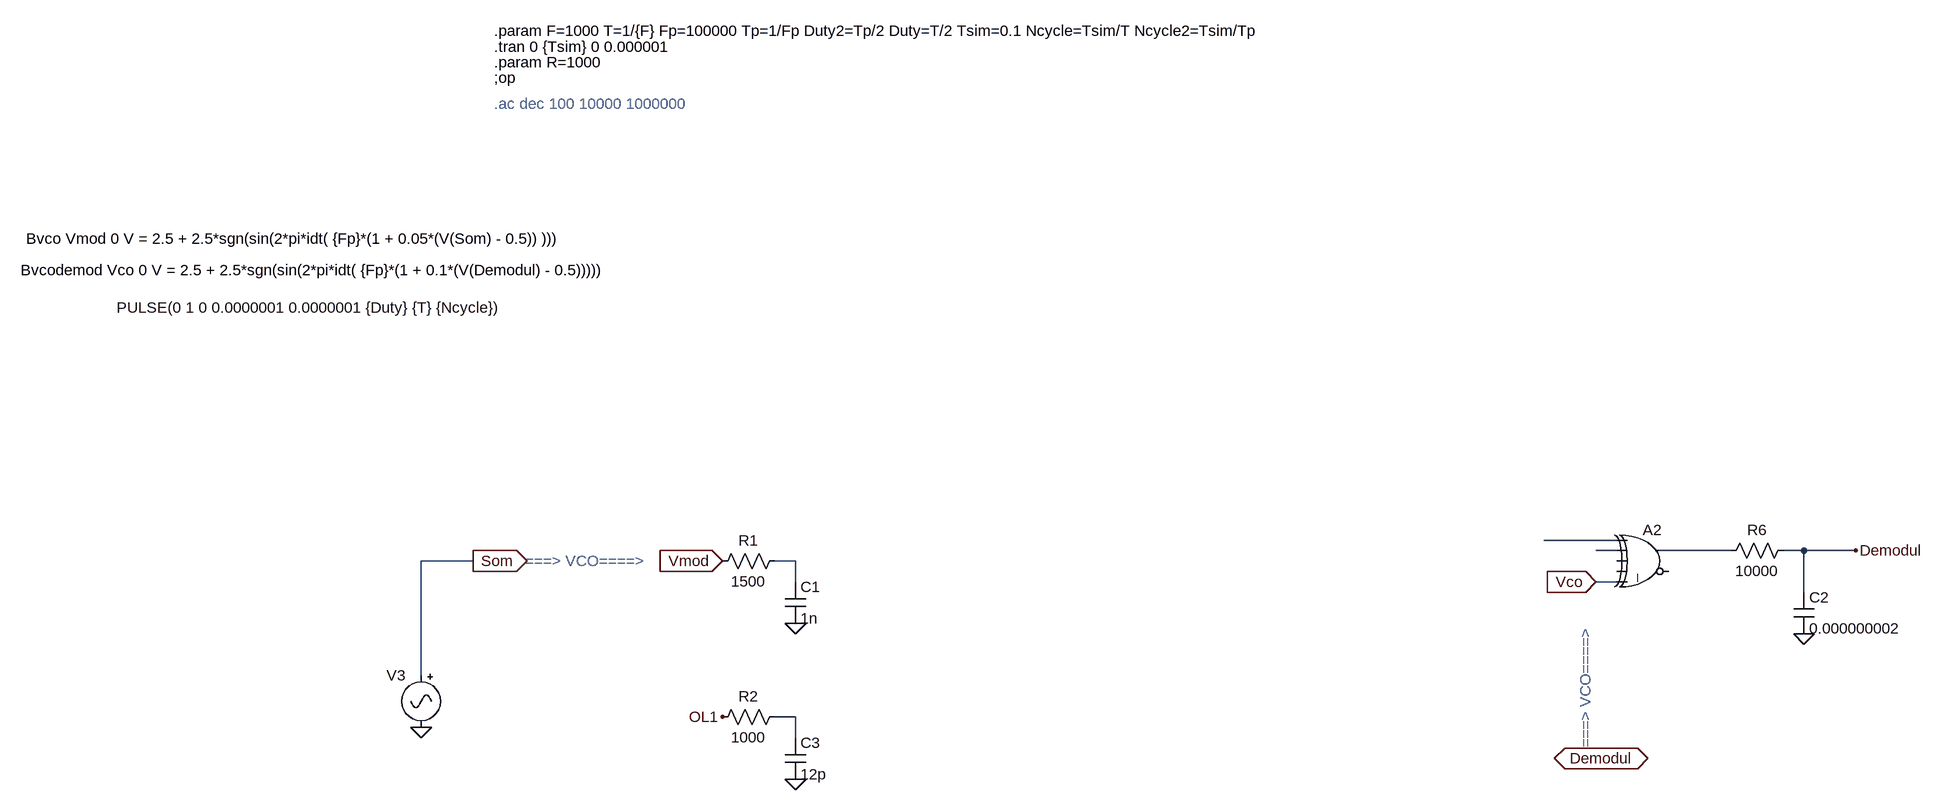
[diagram p0: schematic sommateur.asc]
sommateur.asc, the LTspice schematic file:
Version 4.1
SHEET 1 1820 1652
WIRE 816 160 704 160
WIRE 816 176 784 176
WIRE 992 176 880 176
WIRE 1104 176 1072 176
WIRE 1184 176 1104 176
WIRE -944 192 -1024 192
WIRE -448 192 -480 192
WIRE -448 224 -448 192
WIRE 816 224 784 224
WIRE 1104 240 1104 176
WIRE -1024 368 -1024 192
WIRE -448 432 -480 432
WIRE -448 464 -448 432
FLAG -944 192 Som
IOPIN -944 192 Out
FLAG -1024 448 0
FLAG 1184 176 Demodul
FLAG 784 224 Vco
IOPIN 784 224 In
FLAG 1104 304 0
FLAG 720 496 Demodul
IOPIN 720 496 BiDir
FLAG -560 192 Vmod
IOPIN -560 192 In
FLAG -448 288 0
FLAG -448 528 0
FLAG -560 432 OL1
SYMBOL Misc\\signal -1024 352 M0
WINDOW 123 0 0 Left 0
WINDOW 39 0 0 Left 0
WINDOW 3 -129 -550 Left 2
SYMATTR Value PULSE(0 1 0 0.0000001 0.0000001 {Duty} {T} {Ncycle})
SYMATTR InstName V3
SYMBOL Digital\\xor 864 128 R0
SYMATTR InstName A2
SYMBOL res 1088 160 R90
WINDOW 0 0 56 VBottom 2
WINDOW 3 32 56 VTop 2
SYMATTR InstName R6
SYMATTR Value 10000
SYMBOL cap 1088 240 R0
SYMATTR InstName C2
SYMATTR Value 0.000000002
SYMBOL res -464 176 R90
WINDOW 0 0 56 VBottom 2
WINDOW 3 32 56 VTop 2
SYMATTR InstName R1
SYMATTR Value 1500
SYMBOL cap -464 224 R0
SYMATTR InstName C1
SYMATTR Value 1n
SYMBOL res -464 416 R90
WINDOW 0 0 56 VBottom 2
WINDOW 3 32 56 VTop 2
SYMATTR InstName R2
SYMATTR Value 1000
SYMBOL cap -464 464 R0
SYMATTR InstName C3
SYMATTR Value 12p
TEXT -912 -576 Left 2 !.param R=1000
TEXT -912 -552 Left 2 !;op
TEXT -912 -600 Left 2 !.tran 0 {Tsim} 0 0.000001
TEXT -912 -624 Left 2 !.param F=1000 T=1/{F} Fp=100000 Tp=1/Fp Duty2=Tp/2 Duty=T/2 Tsim=0.1 Ncycle=Tsim/T Ncycle2=Tsim/Tp
TEXT 768 480 VLeft 2 ;===> VCO====>
TEXT -1640 -256 Left 2 !Bvcodemod Vco 0 V = 2.5 + 2.5*sgn(sin(2*pi*idt( {Fp}*(1 + 0.1*(V(Demodul) - 0.5)))))
TEXT -1632 -304 Left 2 !Bvco Vmod 0 V = 2.5 + 2.5*sgn(sin(2*pi*idt( {Fp}*(1 + 0.05*(V(Som) - 0.5)) )))
TEXT -864 192 Left 2 ;===> VCO====>
TEXT -912 -512 Left 2 ;.ac dec 100 10000 1000000

The netlist it stands for:
* sommateur.asc
V3 Som 0 PULSE(0 1 0 0.0000001 0.0000001 {Duty} {T} {Ncycle})
A2 N001 N002 0 0 Vco 0 N003 0 XOR
R6 Demodul N003 10000
C2 Demodul 0 0.000000002
R1 N004 Vmod 1500
C1 N004 0 1n
R2 N005 OL1 1000
C3 N005 0 12p
.param R=1000
;op
.tran 0 {Tsim} 0 0.000001
.param F=1000 T=1/{F} Fp=100000 Tp=1/Fp Duty2=Tp/2 Duty=T/2 Tsim=0.1 Ncycle=Tsim/T Ncycle2=Tsim/Tp
* ===> VCO====>
Bvcodemod Vco 0 V = 2.5 + 2.5*sgn(sin(2*pi*idt( {Fp}*(1 + 0.1*(V(Demodul) - 0.5)))))
Bvco Vmod 0 V = 2.5 + 2.5*sgn(sin(2*pi*idt( {Fp}*(1 + 0.05*(V(Som) - 0.5)) )))
* ===> VCO====>
* .ac dec 100 10000 1000000
.backanno
.end